# Altium schematic sheet SOE-RF.SchDoc: ONDAS DE ESPÍN - ANALÓGICAS
size A3; ApprovedBy: ---; Author: MARIO DE MIGUEL; SheetNumber: 7; SheetTotal: 7; ProjectTitle: SENSACIONAL 2
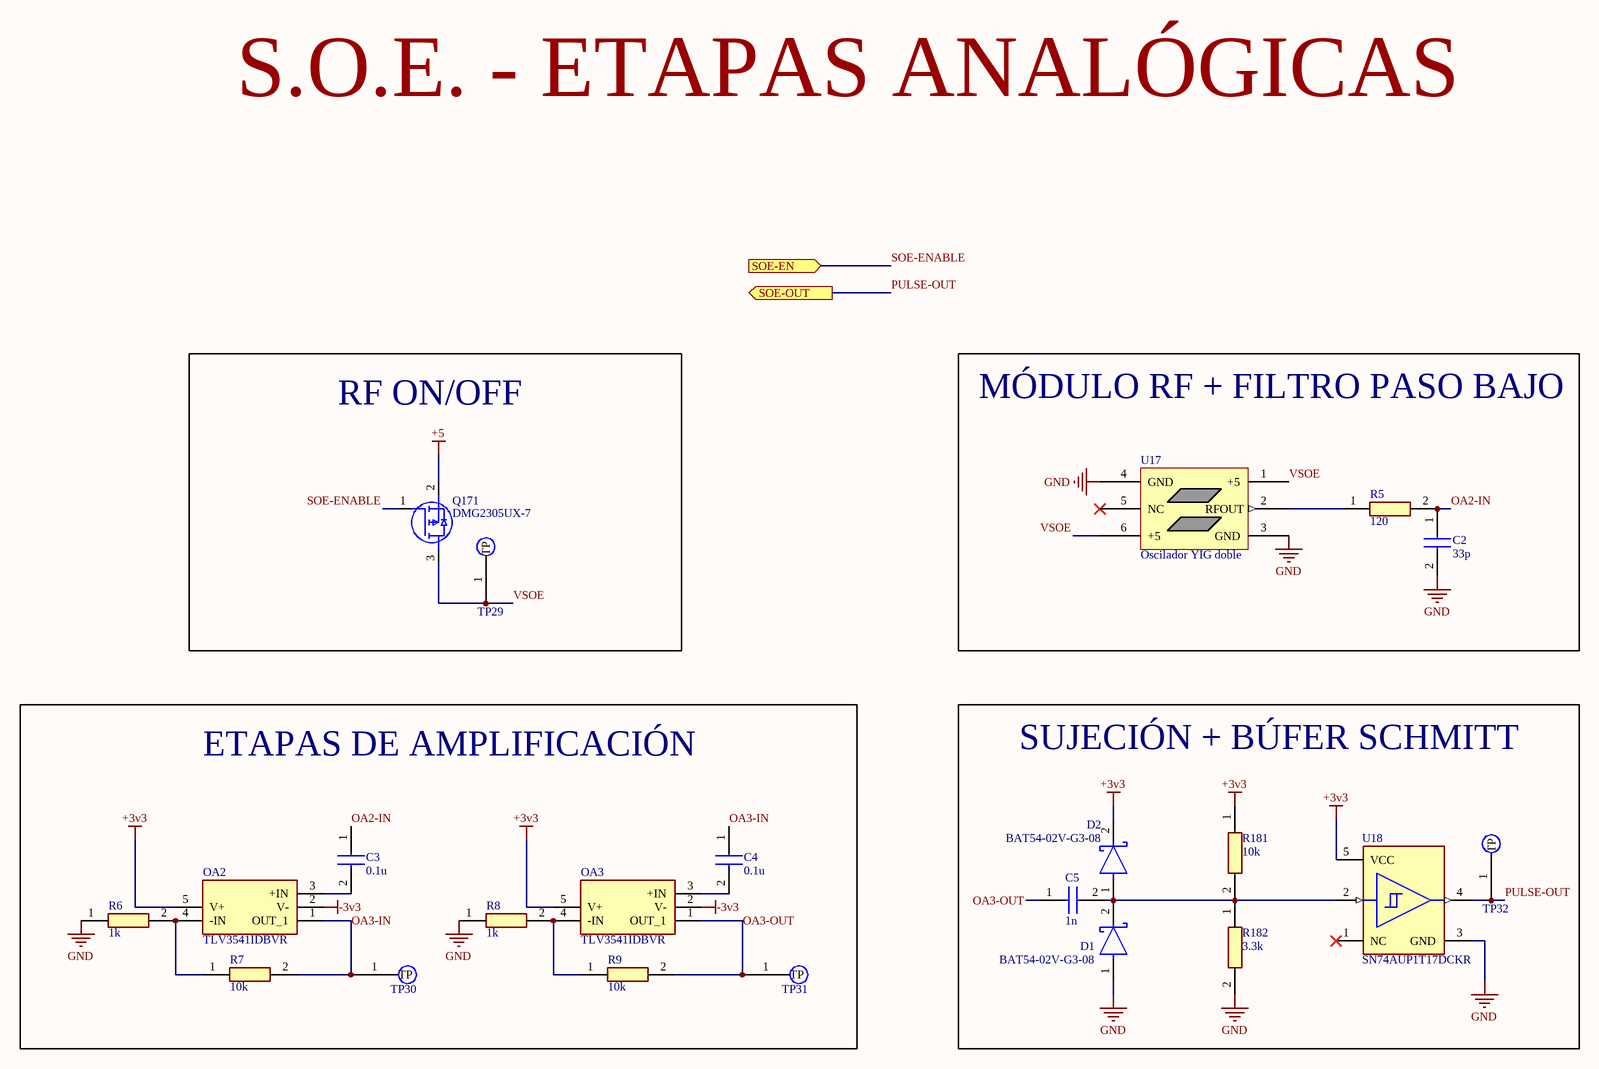
[diagram p0: SOE-RF.SchDoc]

## Parts
C2  33p  [CAPC1608X90N]
C3  0.1u  [CAPC1005X22N]
C4  0.1u  [CAPC1005X22N]
C5  1n  [CAPC1005X55N]
D1  BAT54-02V-G3-08  [FP-S8-V-3880_02-003-MFG]
D2  BAT54-02V-G3-08  [FP-S8-V-3880_02-003-MFG]
OA2  TLV3541IDBVR  [SOT95P280X145-5N]
OA3  TLV3541IDBVR  [SOT95P280X145-5N]
Q171  DMG2305UX-7  [SOT96P240X115-3N]
R5  120  [RESC1608X55N]
R6  1k  [ERA6AEB101V]
R7  10k  [RESC1005X40N]
R8  1k  [ERA6AEB101V]
R9  10k  [RESC1005X40N]
R181  10k  [RESC1005X40N]
R182  3.3k  [ERA3AEB101V]
TP29  Testpoint  [Testpoint_TH]  (value not drawn)  (no BOM)
TP30  Testpoint  [TESTPOINT_SMD]  (value not drawn)  (no BOM)
TP31  Testpoint  [TESTPOINT_SMD]  (value not drawn)  (no BOM)
TP32  Testpoint  [TESTPOINT_SMD]  (value not drawn)  (no BOM)
U17  Oscilador YIG doble  [RF-MODULE-DOUBLE-COMPAT]  (no BOM)
U18  SN74AUP1T17DCKR  [FP-DCK0005A-IPC_B]

## Blocks framed on the sheet
RF ON/OFF: Q171 TP29
MÓDULO RF + FILTRO PASO BAJO: C2 R5 U17
SUJECIÓN + BÚFER SCHMITT: C5 D1 D2 R181 R182 TP32 U18

## Ports
SOE-EN (in), SOE-OUT (out)

## Nets
+3v3: D2.2(C) OA2.5(V+) OA3.5(V+) R181.1 U18.5(VCC)
+5: Q171.2(S)
-3v3: OA2.2(V-) OA3.2(V-)
GND: C2.2 D1.1(A) R6.1 R8.1 R182.2 U17.3(GND) U17.4(GND) U18.3(GND)
OA2-IN: C2.1 C3.1 R5.2
OA3-IN: C4.1 OA2.1(OUT_1) R7.2 TP30.1(TP)
OA3-OUT: C5.1 OA3.1(OUT_1) R9.2 TP31.1(TP)
PULSE-OUT: TP32.1(TP) U18.4(Y) ; port SOE-OUT
SOE-ENABLE: Q171.1(G) ; port SOE-EN
VSOE: Q171.3(D) TP29.1(TP) U17.1(+5) U17.6(+5)
NetC3_2: C3.2 OA2.3(+IN)
NetC4_2: C4.2 OA3.3(+IN)
NetC5_2: C5.2 D1.2(C) D2.1(A) R181.2 R182.1 U18.2(A)
NetOA2_4: OA2.4(-IN) R6.2 R7.1
NetOA3_4: OA3.4(-IN) R8.2 R9.1
NetR5_1: R5.1 U17.2(RFOUT)

Not connected (* = marked no-connect by the designer): U17 5(NC)*; U18 1(NC)*

## Notes on the sheet
- S.O.E. - ETAPAS ANALÓGICAS
- ETAPAS DE AMPLIFICACIÓN
- Title:
- Author:
- Approved:
- Size:
- Date:
- Git Hash:
- A3
- Prj:
- SW Version:
- Variant:
- Edited:
- CERN-OHL-S-2.0
- File:

## Library data of the parts
C2 = GRM1885C1H330GA01J: Capacitor; Manufacturer_Name: Murata Electronics; Datasheet Link: https://search.murata.co.jp/Ceramy/image/img/A01X/G101/ENG/GRM1885C1H330GA01-01A.pdf; Height: 0.9mm; Manufacturer_Part_Number: GRM1885C1H330GA01J; Mouser Part Number: 81-GRM185C1H330GA01J; Mouser Price/Stock: https://www.mouser.co.uk/ProductDetail/Murata-Electronics/GRM1885C1H330GA01J?qs=l2wAu0FthdYr%2FlCbBXZ7Kw%3D%3D
C3 C4 = GRM152R61A104KE19D: Capacitor; Manufacturer_Name: Murata Electronics; Datasheet Link: https://search.murata.co.jp/Ceramy/image/img/A01X/G101/ENG/GRM152R61A104KE19-01A.pdf; Height: 0.22mm; Manufacturer_Part_Number: GRM152R61A104KE19D; Mouser Part Number: 81-GRM152R61A104KE9D; Mouser Price/Stock: https://www.mouser.co.uk/ProductDetail/Murata-Electronics/GRM152R61A104KE19D?qs=IPQhFcwEUOjgOs7G%2Fz457g%3D%3D; Arrow Part Number: GRM152R61A104KE19D; Arrow Price/Stock: https://www.arrow.com/en/products/grm152r61a104ke19d/murata-manufacturing
C5 = C1005X7S2A102K050BB: Capacitor; Manufacturer_Name: TDK; Datasheet Link: https://product.tdk.com/info/en/catalog/datasheets/mlcc_commercial_midvoltage_en.pdf; Height: 0.55mm; Manufacturer_Part_Number: C1005X7S2A102K050BB; Mouser Part Number: 810-C1005X7S2A102K; Mouser Price/Stock: https://www.mouser.co.uk/ProductDetail/TDK/C1005X7S2A102K050BB?qs=dfay7wIA1uHf1clOoZRYuw%3D%3D; Arrow Part Number: C1005X7S2A102K050BB; Arrow Price/Stock: https://www.arrow.com/en/products/c1005x7s2a102k050bb/tdk
D1 D2 = CMP-00030-115842002-1: BAT54-02V-G3-08 Schottky Diode Sod52330V, 0.4V@10Ma, Ifmax=200Ma; Reverse Voltage: 30V; Forward Current: 200mA; Peak Reverse Current: 2µA; Max Forward Surge Current (Ifsm): 600mA; Max Junction Temperature (Tj): 125°C; Capacitance: 10pF; Min Operating Temperature: -55°C; Schedule B: 8541100070; Max Operating Temperature: 125°C; Height: 750µm; Max Repetitive Reverse Voltage (Vrrm): 30V; NexarPartId: 115842002
OA2 OA3 = TLV3541IDBVR: Integrated Circuit; Manufacturer_Name: Texas Instruments; Datasheet Link: http://www.ti.com/lit/gpn/tlv3541; Height: 1.45mm; Manufacturer_Part_Number: TLV3541IDBVR; Mouser Part Number: 595-TLV3541IDBVR; Mouser Price/Stock: https://www.mouser.co.uk/ProductDetail/Texas-Instruments/TLV3541IDBVR?qs=9lcNTSmDlCoQ%2FjlOWHAJGw%3D%3D; Arrow Part Number: TLV3541IDBVR; Arrow Price/Stock: https://www.arrow.com/en/products/tlv3541idbvr/texas-instruments?utm_currency=USD&region=nac
Q171 = DMG2305UX-7: MOSFET (P-Channel); Manufacturer_Name: Diodes Incorporated; Datasheet Link: https://www.diodes.com//assets/Datasheets/DMG2305UX.pdf; Height: 1.15mm; Manufacturer_Part_Number: DMG2305UX-7; Mouser Part Number: 621-DMG2305UX-7; Mouser Price/Stock: https://www.mouser.co.uk/ProductDetail/Diodes-Incorporated/DMG2305UX-7?qs=L1DZKBg7t5F%2FNBHrjfxC%252Bg%3D%3D; Arrow Part Number: DMG2305UX-7; Arrow Price/Stock: https://www.arrow.com/en/products/dmg2305ux-7/diodes-incorporated?utm_currency=USD&region=nac
R5 = RC0603FR-07120RL: Resistor; Manufacturer_Name: YAGEO; Datasheet Link: https://www.mouser.com/catalog/specsheets/YAGEO_PYu_RC_Group_51_RoHS_L_12.pdf?_gl=1*5hpezi*_gcl_aw*R0NMLjE3NTY5MzA3MzEuQ2owS0NRand6dF9GQmhDRUFSSXNBSkdGV1ZrR0pJbGZ2SC1TLWtqd2F3R0Z3ZnVtQXo0QkJFOU1Yc09CTTdEdzR5bkJuckt0ZDhiRi12TWFBb1FlRUFMd193Y0I.*_gcl_au*MTA; Height: 0.55mm; Manufacturer_Part_Number: RC0603FR-07120RL; Mouser Part Number: 603-RC0603FR-07120RL; Mouser Price/Stock: https://www.mouser.co.uk/ProductDetail/YAGEO/RC0603FR-07120RL?qs=uM1JSSdPjOCKJQFXEGGb5w%3D%3D; Arrow Part Number: RC0603FR-07120RL; Arrow Price/Stock: https://www.arrow.com/en/products/rc0603fr-07120rl/yageo?utm_currency=USD&region=nac
R6 R8 = ERA-6ARW102V: Resistor; Manufacturer_Name: Panasonic; Datasheet Link: https://industrial.panasonic.com/cdbs/www-data/pdf/RDM0000/AOA0000C307.pdf; Height: 0.6mm; Manufacturer_Part_Number: ERA-6ARW102V; Mouser Part Number: 667-ERA-6ARW102V; Mouser Price/Stock: https://www.mouser.co.uk/ProductDetail/Panasonic/ERA-6ARW102V?qs=ob%252BdNz2%252BYEgF8szbcT859A%3D%3D
R7 R9 R181 = RCA040210K0JNED: Resistor; Manufacturer_Name: Vishay; Datasheet Link: https://www.vishay.com/docs/20037/rcae3.pdf; Height: 0.4mm; Manufacturer_Part_Number: RCA040210K0JNED; Mouser Part Number: 71-RCA040210K0JNED; Mouser Price/Stock: https://www.mouser.co.uk/ProductDetail/Vishay-Draloric/RCA040210K0JNED?qs=MG8z16zmaH46yN0G7Zhn3Q%3D%3D; Arrow Part Number: RCA040210K0JNED; Arrow Price/Stock: https://www.arrow.com/en/products/rca040210k0jned/vishay?region=nac
R182 = ERA-3ARB332V: Resistor; Manufacturer_Name: Panasonic; Datasheet Link: https://industrial.panasonic.com/cdbs/www-data/pdf/RDM0000/AOA0000C307.pdf; Height: 0.55mm; Manufacturer_Part_Number: ERA-3ARB332V; Mouser Part Number: 667-ERA-3ARB332V; Mouser Price/Stock: https://www.mouser.co.uk/ProductDetail/Panasonic/ERA-3ARB332V?qs=ob%252BdNz2%252BYEh5VQ0ijNW7%252BQ%3D%3D
U17 = SWS_MODULE_CROSS
U18 = CMP-0859-00332-5: IC BUF NON-INVERT 3.6V SC70-5; Turn-On Delay Time: 10.8ns; Nominal Supply Current: 900nA; Logic Function: Schmitt Trigger; Number of Bits: 1; Schmitt Trigger Input: Yes; Min Supply Voltage: 2.3V; Propagation Delay: 5.1ns; Low Level Output Current: 4mA; High Level Output Current: -4mA; Quiescent Current: 500nA; Polarity: Non-Inverting; REACH SVHC: No SVHC; Lead Free: Lead Free; Case/Package: SC; Radiation Hardening: No; Mount: Surface Mount; Technology: CMOS; Number of Elements: 1; Length: 2.15mm; Number of Outputs: 1; Number of Channels: 1; RoHS Compliant: Yes; Supply Current: 900nA; Number of Bits per Element: 1; Package Quantity: 3000; Series: 74AUP; Number of Inputs: 1; Width: 1.4mm; Max Operating Temperature: 85°C; Number of Gates: 1; Height: 1mm; Packaging: Tape and Reel; Max Supply Voltage: 3.6V; Min Operating Temperature: -40°C; Number of Pins: 5